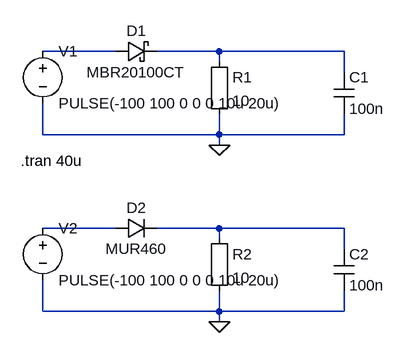
[diagram p0: schematic Diode Simulation.asc]
Diode Simulation.asc, the LTspice schematic file:
Version 4
SHEET 1 880 680
WIRE 128 96 16 96
WIRE 288 96 192 96
WIRE 480 96 288 96
WIRE 288 112 288 96
WIRE 480 128 480 96
WIRE 16 224 16 176
WIRE 288 224 288 192
WIRE 288 224 16 224
WIRE 480 224 480 192
WIRE 480 224 288 224
WIRE 288 240 288 224
WIRE 128 368 16 368
WIRE 288 368 192 368
WIRE 480 368 288 368
WIRE 288 384 288 368
WIRE 480 400 480 368
WIRE 16 496 16 448
WIRE 288 496 288 464
WIRE 288 496 16 496
WIRE 480 496 480 464
WIRE 480 496 288 496
WIRE 288 512 288 496
FLAG 288 240 0
FLAG 288 512 0
SYMBOL schottky 128 112 R270
WINDOW 0 32 32 VTop 2
WINDOW 3 0 32 VBottom 2
SYMATTR InstName D1
SYMATTR Value MBR20100CT
SYMATTR Description Diode
SYMATTR Type diode
SYMBOL voltage 16 80 R0
WINDOW 123 0 0 Left 2
WINDOW 39 0 0 Left 2
SYMATTR InstName V1
SYMATTR Value PULSE(-100 100 0 0 0 10u 20u)
SYMBOL Misc\\EuropeanResistor 272 96 R0
SYMATTR InstName R1
SYMATTR Value 10
SYMBOL cap 464 128 R0
SYMATTR InstName C1
SYMATTR Value 100n
SYMBOL diode 128 384 R270
WINDOW 0 32 32 VTop 2
WINDOW 3 0 32 VBottom 2
SYMATTR InstName D2
SYMATTR Value MUR460
SYMBOL voltage 16 352 R0
WINDOW 123 0 0 Left 2
WINDOW 39 0 0 Left 2
SYMATTR InstName V2
SYMATTR Value PULSE(-100 100 0 0 0 10u 20u)
SYMBOL Misc\\EuropeanResistor 272 368 R0
SYMATTR InstName R2
SYMATTR Value 10
SYMBOL cap 464 400 R0
SYMATTR InstName C2
SYMATTR Value 100n
TEXT -18 264 Left 2 !.tran 40u

The netlist it stands for:
* Diode Simulation.asc
D1 N001 N002 MBR20100CT
V1 N001 0 PULSE(-100 100 0 0 0 10u 20u)
R1 N002 0 10
C1 N002 0 100n
D2 N003 N004 MUR460
V2 N003 0 PULSE(-100 100 0 0 0 10u 20u)
R2 N004 0 10
C2 N004 0 100n
.model D D
.lib standard.dio
.tran 40u
.backanno
.end